# EAGLE design Arduino_Pro_Mini_Mother_Board_1.1 (EAGLE 7.3.0)
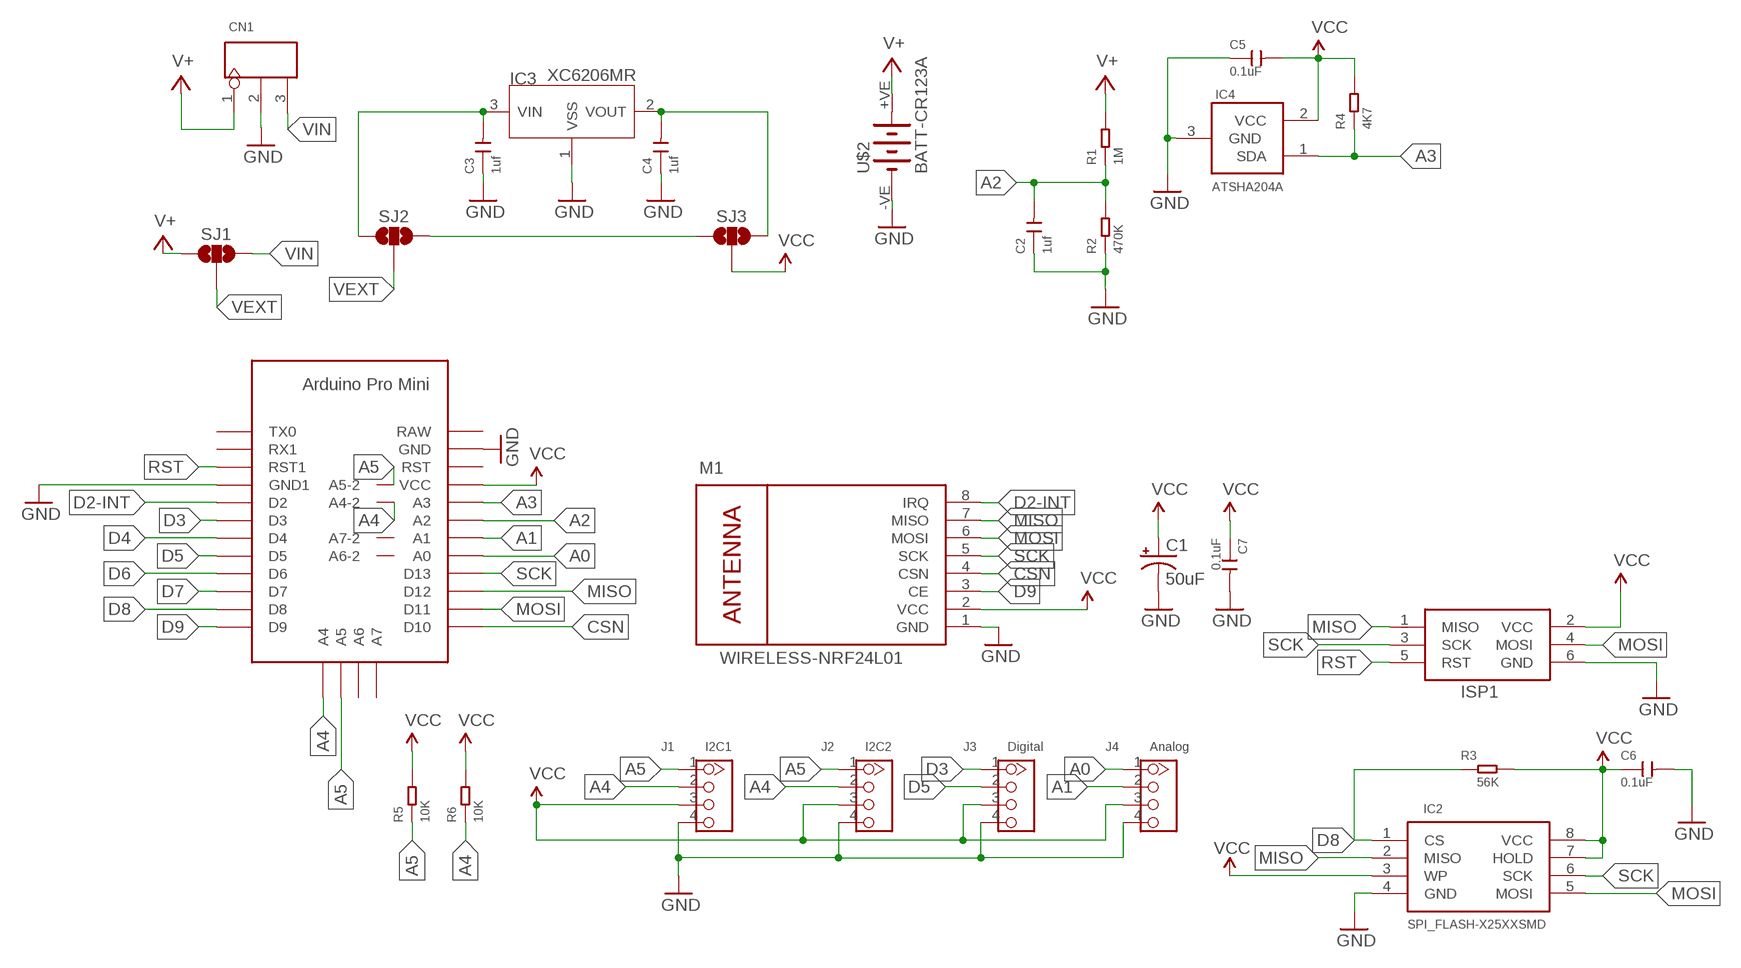
[diagram p0: schematic, sheet 1]

## Parts
ARDUINOPROMINI  PRO-MINI-UNIVERSAL  [PRO-MINI-UINIVERSAL]
C1  50uF  CAP_POL6032  [EIA6032]
C2  1uf  CERAMIC-1UF-25V-10%-X7R(0603)  [C0603]
C3  1uf  CERAMIC-1UF-25V-10%-X7R(0603)  [C0603]
C4  1uf  CERAMIC-1UF-25V-10%-X7R(0603)  [C0603]
C5  0.1uF  CERAMIC-1UF-25V-10%-X7R(0603)  [C0603]
C6  0.1uF  CERAMIC-1UF-25V-10%-X7R(0603)  [C0603]
C7  0.1uF  CERAMIC-1UF-25V-10%-X7R(0603)  [C0603]
CN1  DIP-BLACK-MALE-HEADER-VERT(3P-2.54)  [H3-2.54]
IC2  SPI_FLASH-X25XXSMD  [SO08]
IC3  XC6206MR  [SOT23]
IC4  ATSHA204A  [SOT23]
ISP1  AVRISP-6  [AVRISP]
J1  I2C1  GROVE-CONNECTOR-DIP(4P-2.0)  [HW4-2.0]
J2  I2C2  GROVE-CONNECTOR-DIP(4P-2.0)  [HW4-2.0]
J3  Digital  GROVE-CONNECTOR-DIP(4P-2.0)  [HW4-2.0]
J4  Analog  GROVE-CONNECTOR-DIP(4P-2.0)  [HW4-2.0]
M1  WIRELESS-NRF24L01  [WIRELESS-NRF24L01]
R1  1M  SMD-RES-1M-1%-1/10W(0603)  [R0603]
R2  470K  SMD-RES-470K-1%-1/10W(0603)  [R0603]
R3  56K  SMD-RES-470K-1%-1/10W(0603)  [R0603]
R4  4K7  SMD-RES-470K-1%-1/10W(0603)  [R0603]
R5  10K  SMD-RES-1M-1%-1/10W(0603)  [R0603]
R6  10K  SMD-RES-1M-1%-1/10W(0603)  [R0603]
SJ1  SOLDERJUMPER_2WAYS  [SJ_3]
SJ2  SOLDERJUMPER_2WAYS  [SJ_3]
SJ3  SOLDERJUMPER_2WAYS  [SJ_3]
U$2  BATT-CR123A  [KEYSTONE-2/3A]

## Nets
A0: ARDUINOPROMINI.A0 J4.1
A1: ARDUINOPROMINI.A1 J4.2
A2: ARDUINOPROMINI.A2 C2.2 R1.1 R2.2
A3: ARDUINOPROMINI.A3 IC4.1(SDA) R4.1
A4: ARDUINOPROMINI.A4 ARDUINOPROMINI.A4-2 J1.2 J2.2 R6.1
A5: ARDUINOPROMINI.A5 ARDUINOPROMINI.A5-2 J1.1 J2.1 R5.1
CSN: ARDUINOPROMINI.D10 M1.4(CSN)
D2-INT: ARDUINOPROMINI.D2 M1.8(IRQ)
D3: ARDUINOPROMINI.D3 J3.1
D4: ARDUINOPROMINI.D4
D5: ARDUINOPROMINI.D5 J3.2
D6: ARDUINOPROMINI.D6
D7: ARDUINOPROMINI.D7
D8: ARDUINOPROMINI.D8 IC2.1(CS) R3.1
D9: ARDUINOPROMINI.D9 M1.3(CE)
GND [GND]: ARDUINOPROMINI.GND0(GND) ARDUINOPROMINI.GND1 C1.P$2(-) C2.1 C3.1 C4.1 C5.1 C6.2 C7.2 CN1.2 IC2.4(GND) IC3.1(VSS) IC4.3(GND) ISP1.6(GND) J1.4 J2.4 J3.4 J4.4 M1.1(GND) R2.1 U$2.-VE(-)
MISO: ARDUINOPROMINI.D12 IC2.2(MISO) ISP1.1(MISO) M1.7(MISO)
MOSI: ARDUINOPROMINI.D11 IC2.5(MOSI) ISP1.4(MOSI) M1.6(MOSI)
RST: ARDUINOPROMINI.RST1 ISP1.5(RST)
SCK: ARDUINOPROMINI.D13 IC2.6(SCK) ISP1.3(SCK) M1.5(SCK)
V2 [VCC]: SJ2.3 SJ3.1
V4 [VDD]: C4.2 IC3.2(VOUT) SJ3.3
V+ [VCC]: CN1.1 R1.2 SJ1.1 U$2.+VE(+)
VCC [VCC]: ARDUINOPROMINI.VCC C1.P$1(+) C5.2 C6.1 C7.1 IC2.3(WP) IC2.7(HOLD) IC2.8(VCC) IC4.2(VCC) ISP1.2(VCC) J1.3 J2.3 J3.3 J4.3 M1.2(VCC) R3.2 R4.2 R5.2 R6.2 SJ3.2
VEXT [VCC]: SJ1.2 SJ2.2
VIN [VCC]: C3.2 CN1.3 IC3.3(VIN) SJ1.3 SJ2.1
Unconnected: ARDUINOPROMINI.A6 ARDUINOPROMINI.A6-2 ARDUINOPROMINI.A7 ARDUINOPROMINI.A7-2 ARDUINOPROMINI.RAW ARDUINOPROMINI.RST ARDUINOPROMINI.RX1 ARDUINOPROMINI.TX0

## Library data of the parts
ARDUINOPROMINI = Arduino-clone:PRO-MINI-UNIVERSAL
C1 = SparkFun-Capacitors:CAP_POL: Capacitor Polarized These are standard SMD and PTH capacitors. Normally 10uF, 47uF, and 100uF in electrolytic and tantalum varieties. Always verify the external diameter of the through hole cap, it varies with capacity, voltage, and manufacturer. The EIA devices should be standard.
C2-C4 = Seeed-OPL-Capacitor:CERAMIC-1UF-25V-10%-X7R(0603): 302010139; MPN: CC0603KRX7R8BB105
C5-C7 = Seeed-OPL-Capacitor:CERAMIC-1UF-25V-10%-X7R(0603): 302010139; MPN: CC0603KRX7R8BB105; VALUE: 1uf
CN1 = Seeed-OPL-Connector:DIP-BLACK-MALE-HEADER-VERT(3P-2.54): 320020079
IC2 = SparkFun-DigitalIC:SPI_FLASH-X25XX: 8pin SPI Flash series x25xx. Works with devices like W25X32 and BR25L32
IC3 = IC:XC6206: LOW ESR Cap.Compatible Positive Voltage Regulators
IC4 = Sensor:ATSHA204A
ISP1 = adafruit:AVRISP: AVR ISP HEADER Standard 6 pin header for AVR programming
J1-J4 = Seeed-OPL-Connector:GROVE-CONNECTOR-DIP(4P-2.0): 320110033
M1 = diy-modules:WIRELESS-NRF24L01: 2.4 GHz Wireless Module based on NRF24L01 chip
R1 = Seeed-OPL-Resistor:SMD-RES-1M-1%-1/10W(0603): 301010151; MPN: RC0603FR-071ML
R2 = Seeed-OPL-Resistor:SMD-RES-470K-1%-1/10W(0603): 301010190; MPN: RC0603FR-07470KL
R3 R4 = Seeed-OPL-Resistor:SMD-RES-470K-1%-1/10W(0603): 301010190; MPN: RC0603FR-07470KL; VALUE: 470K
R5 R6 = Seeed-OPL-Resistor:SMD-RES-1M-1%-1/10W(0603): 301010151; MPN: RC0603FR-071ML; VALUE: 1M
SJ1-SJ3 = SparkFun-Retired:SOLDERJUMPER_2WAY: Solder Jumper 2 way solder jumper
U$2 = eagle-library-edeca.net-v5:BATT-CR123A: CR123A (2/3rd AA) battery holder Manufacturer: Keystone Mouser part: 534-1019

## Net classes
0 default: width 0.254 mm, drill 0.254 mm, clearance 0.254 mm
1 VCC: width 0.381 mm, drill 0.381 mm, clearance 0.254 mm
2 3V3: width 0.381 mm, drill 0.381 mm, clearance 0.254 mm
3 GND: width 0.381 mm, drill 0.381 mm, clearance 0.254 mm
4 VDD: width 0.381 mm, drill 0.381 mm, clearance 0.254 mm

## Board
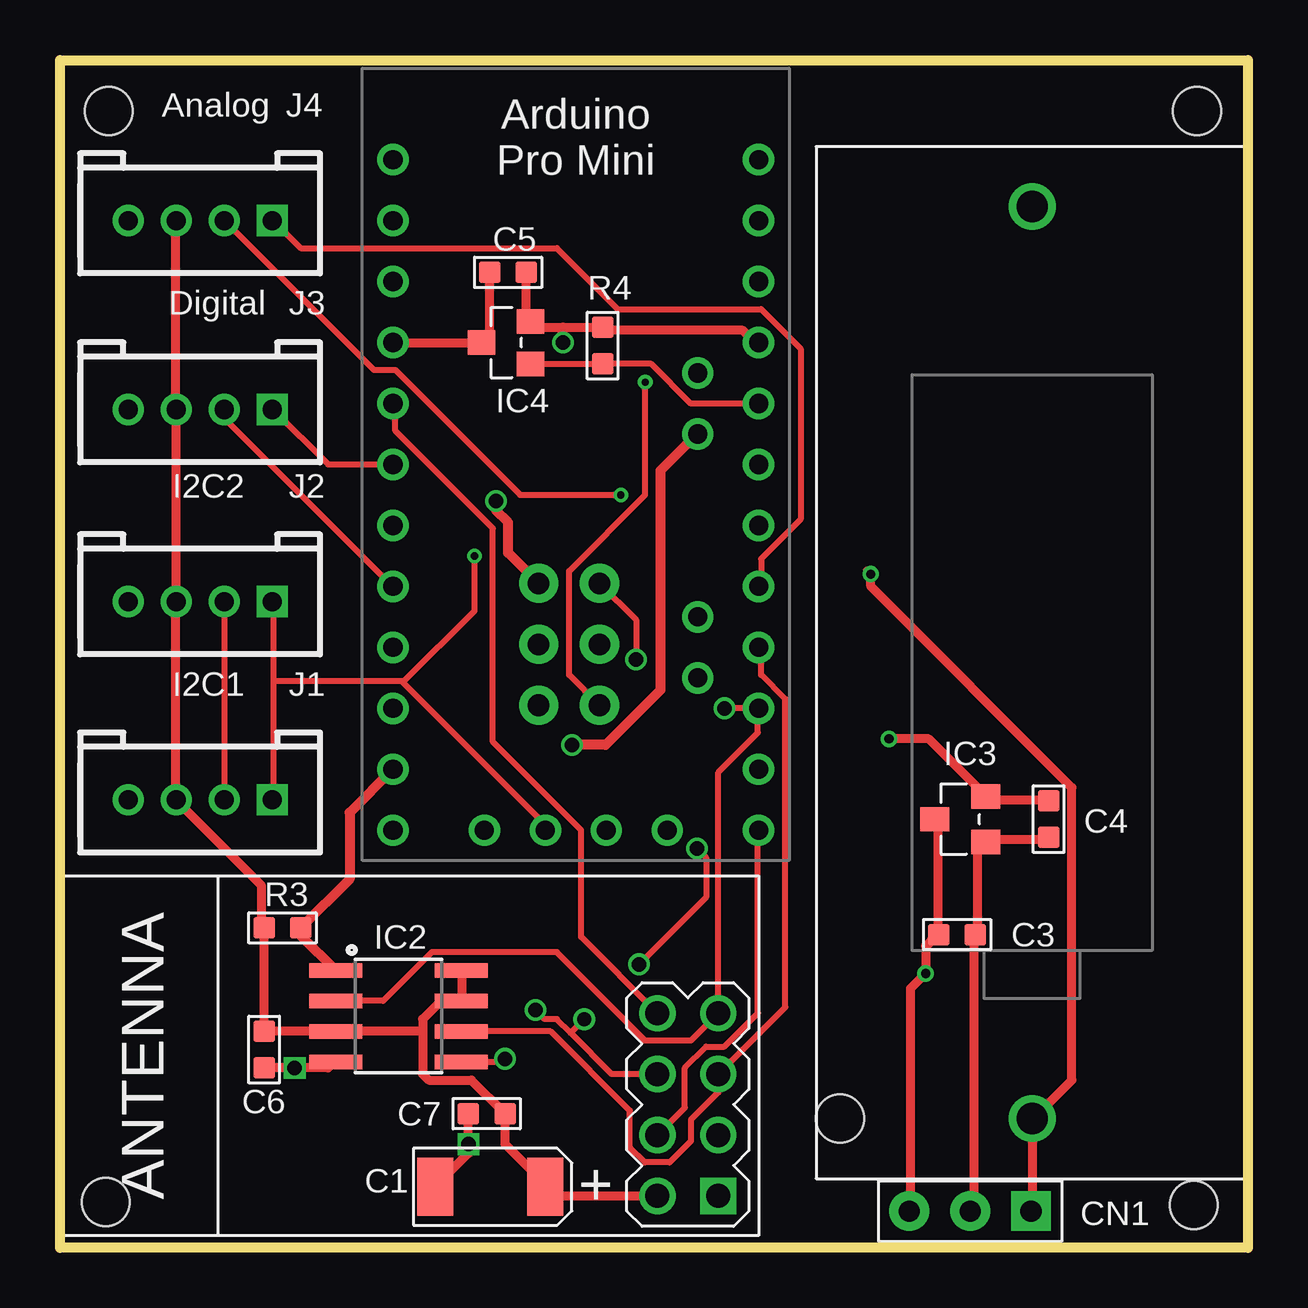
[diagram p1: board, top side]
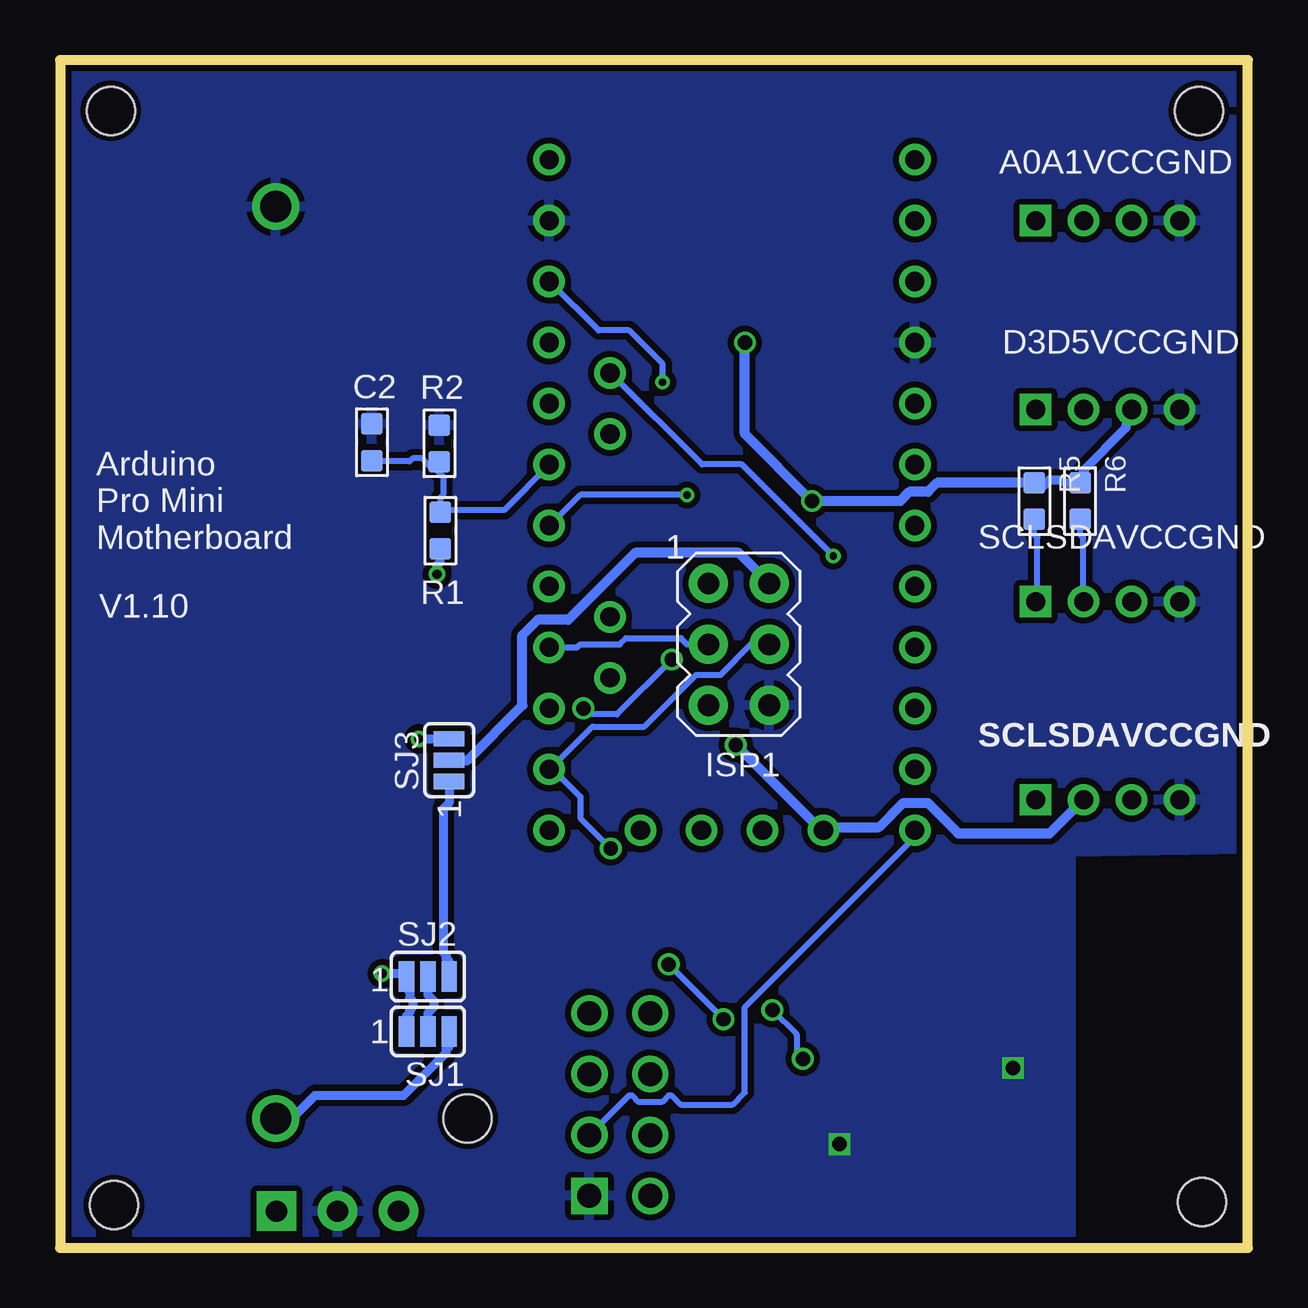
[diagram p2: board, bottom side, seen from below]

Size 49.49 x 49.49 mm. Coordinates in mm from the lower left corner, seen from the top.
Outline: 0,0 0,49.49 49.49,49.49 49.49,0 0,0
Copper layers (1*16): Top 0.035mm / dielectric 1.5mm / Bottom 0.035mm
Design rules "SeeedStudio_2layer_DRU_no_angle_20140221": minimum track width 6mil, minimum drill 12mil, track to track 6mil, track to pad 6mil, pad to pad 6mil, via to via 6mil, smd to smd 0mil, copper to edge 10mil, drill to drill 10mil, minimum pad ring 10mil, minimum via ring 6mil, stop-mask expansion 2mil, vias tented up to drill 100mil, thermal gap 10mil
Holes 2 mm at 2.03,47.37 1.91,1.91 47.24,1.78 47.37,47.37

### Footprints (pad centres in the part's own frame; a part is rotated, then mirrored left to right if it is on the bottom)
PRO-MINI-UINIVERSAL = drill 0.8: A0 7.62,-3.81; A1 7.62,-1.27; A2 7.62,1.27; A3 7.62,3.81; A4 -3.81,-13.97; A4-2 5.08,2.54; A5 -1.27,-13.97; A5-2 5.08,5.08; A6 1.27,-13.97; A6-2 5.08,-7.62; A7 3.81,-13.97; A7-2 5.08,-5.08; D2 -7.62,3.81; D3 -7.62,1.27; D4 -7.62,-1.27; D5 -7.62,-3.81; D6 -7.62,-6.35; D7 -7.62,-8.89; D8 -7.62,-11.43; D9 -7.62,-13.97; D10 7.62,-13.97; D11 7.62,-11.43; D12 7.62,-8.89; D13 7.62,-6.35; GND0 -7.62,6.35; GND1 7.62,11.43; RAW 7.62,13.97; RST -7.62,8.89; RST1 7.62,8.89; RX1 -7.62,11.43; TX0 -7.62,13.97; VCC 7.62,6.35
EIA6032 = smd 1.5 x 2.4: P$1 -2.3,0; P$2 2.3,0
C0603 = smd 0.889 x 0.889: 1 0,0.762; 2 0,-0.762
H3-2.54 = drill 0.889 pad 1.651 square: 1 0,2.54 | drill 0.889 pad 1.651: 2 0,0; 3 0,-2.54
SO08 = smd 0.61 x 2.21: 1 -1.905,-2.616; 2 -0.635,-2.616; 3 0.635,-2.616; 4 1.905,-2.616; 5 1.905,2.616; 6 0.635,2.616; 7 -0.635,2.616; 8 -1.905,2.616
SOT23 = smd 1.016 x 1.2: 1 -0.95,-1.06; 2 0.95,-1.06; 3 0,1.06
SOT23' = smd 1.016 x 1.143: 1 -0.889,-1.016; 2 0.889,-1.016; 3 0,1.016
AVRISP = drill 0.9 pad 1.626: 1 -1.27,2.54; 2 1.27,2.54; 3 -1.27,0; 4 1.27,0; 5 -1.27,-2.54; 6 1.27,-2.54
HW4-2.0 = drill 0.8 pad 1.27 square: 1 -3,0 | drill 0.8 pad 1.27: 2 -1,0; 3 1,0; 4 3,0
WIRELESS-NRF24L01 = drill 1 square: 1 -12.7,6.35 | drill 1: 2 -10.16,6.35; 3 -12.7,3.81; 4 -10.16,3.81; 5 -12.7,1.27; 6 -10.16,1.27; 7 -12.7,-1.27; 8 -10.16,-1.27
R0603 = smd 0.889 x 0.889: 1 0,0.762; 2 0,-0.762
SJ_3 = smd 0.635 x 1.27: 1 -0.889,0; 2 0,0; 3 0.889,0
KEYSTONE-2/3A = drill 1.3: +VE 0,19; -VE 0,-19 | hole 2: 8,19

### Placement (x,y rotation side)
ARDUINOPROMINI  21.49,31.37 0 top
C1  17.93,2.54 180 top
C2  36.5,33.56 0 bottom
C3  37.38,13.05 270 top
C4  41.2,17.86 180 top
C5  18.67,40.64 90 top
C6  8.51,8.26 0 top
C7  17.78,5.59 270 top
CN1  37.92,1.53 270 top
IC2  14.1,9.65 270 top
IC3  37.51,17.86 90 top
IC4  ATSHA204A  [SOT23']  18.58,37.72 90 top
ISP1  21.21,25.15 0 bottom
J1  5.84,18.67 180 top
J2  5.84,26.92 180 top
J3  5.84,34.93 180 top
J4  5.84,42.8 180 top
M1  14.73,8.51 180 top
R1  33.64,29.88 0 bottom
R2  33.68,33.51 0 bottom
R3  9.27,13.34 270 top
R4  22.61,37.59 180 top
R5  8.89,31.11 180 bottom
R6  6.99,31.11 180 bottom
SJ1  34.16,9.02 180 bottom
SJ2  34.16,11.3 0 bottom
SJ3  33.27,20.32 90 bottom
U$2  40.51,24.38 180 top

### Tracks (layer width: path | path; a pad name or v marks a point on that pad's centre or on a via)
A0
  Top 0.254: ARDUINOPROMINI.A0 29.21,27.56 29.21,28.7 30.86,30.35 30.86,37.47 29.21,39.12 23.24,39.12 20.7,41.66 10.03,41.66 8.89,42.8 J4.1
A1  (via drill 0.3)
  Top 0.254: v23.37,31.37 19.18,31.37 13.97,36.58 13.08,36.58 6.86,42.8 J4.2
  Bottom 0.254: v23.37,31.37 27.81,31.37 29.08,30.1 ARDUINOPROMINI.A1
A2
  Bottom 0.254: 33.78,32.51 33.78,32.64 R2.2 33.78,32.51 | 33.78,32.51 33.78,32.38 33.53,32.13 33.53,31.37 33.66,31.24 33.66,30.73 R1.1 33.53,30.73 30.99,30.73 29.08,32.64 ARDUINOPROMINI.A2 | 33.78,32.51 34.04,32.51 34.42,32.89 34.8,32.89 34.92,32.77 36.45,32.77 C2.2
A3
  Top 0.254: IC4.1 19.68,36.83 R4.1 24.64,36.83 26.29,35.18 ARDUINOPROMINI.A3
A4  (via drill 0.6)
  Top 0.254: J2.2 6.86,26.92 6.86,18.8 J1.2
  Top 0.406: v21.34,20.95 22.73,20.95 25.02,23.24 25.02,32.38 26.54,33.91 ARDUINOPROMINI.A4-2
  Bottom 0.254: R6.1 6.99,29.72 6.86,29.59 6.86,26.92 J2.2
  Bottom 0.406: v21.34,20.95 17.78,17.4 ARDUINOPROMINI.A4 17.53,17.53 15.37,17.53 14.35,18.54 13.34,18.54 12.06,17.27 8.26,17.27 6.86,18.67 J1.2
A5  (via drill 0.3)
  Top 0.254: 8.89,23.62 8.89,26.92 J2.1 | 8.89,23.62 8.89,18.67 J1.1 | 14.29,23.56 14.22,23.62 8.89,23.62 | 14.29,23.56 20.19,17.65 20.19,17.4 ARDUINOPROMINI.A5 | v17.27,28.83 17.27,26.54 14.29,23.56
  Bottom 0.254: v17.27,28.83 21.08,32.64 22.73,32.64 26.54,36.45 ARDUINOPROMINI.A5-2 | R5.1 8.89,29.72 8.76,29.59 8.76,26.92 J2.1
CSN
  Top 0.254: M1.4 26.04,5.84 26.04,7.49 26.92,8.38 27.69,8.38 29.08,9.78 29.08,17.4 ARDUINOPROMINI.D10
D2-INT
  Top 0.254: M1.8 21.72,12.95 21.72,17.4 18.03,21.08 18.03,29.97 13.97,34.04 13.97,35.18 ARDUINOPROMINI.D2
D3
  Top 0.254: ARDUINOPROMINI.D3 11.18,32.64 8.89,34.92 J3.1
D5
  Top 0.254: J3.2 6.86,34.92 6.86,34.54 13.84,27.56 ARDUINOPROMINI.D5
D8
  Top 0.406: ARDUINOPROMINI.D8 12.06,18.13 12.06,15.37 R3.1 10.03,13.01 IC2.1
D9
  Bottom 0.254: M1.3 25.78,6.35 25.65,6.35 25.4,6.1 24.38,6.1 24.13,6.35 24,6.35 23.62,5.97 21.46,5.97 20.95,6.48 20.95,10.03 13.97,17.02 13.97,17.4 ARDUINOPROMINI.D9
GND  (via drill 0.6)
  Top 0.381: C5.1 17.91,37.97 17.65,37.72 IC4.3 17.4,37.72 ARDUINOPROMINI.GND0 | C4.1 41.15,17.02 38.73,17.02 IC3.1 38.48,16.89 38.23,16.64 38.23,13.08 C3.1 38.1,12.95 38.1,1.78 37.97,1.65 CN1.2 | C6.2 v9.78,7.49 11.18,7.49 11.43,7.75 IC2.4 | C7.2 v17.02,4.32 17.02,3.94 15.75,2.67 C1.P$2 | 2.92,18.67 J1.4
  pour Bottom: 0,16.63 0,49.62 49.49,49.49 49.49,0 7.37,0 7.37,16.5
MISO  (via drill 0.6)
  Top 0.254: IC2.2 13.46,10.29 15.49,12.32 20.7,12.32 24.38,8.64 26.29,8.64 M1.7 27.43,19.81 29.08,21.46 29.08,22.48 | 29.08,22.48 v27.69,22.48 | 29.08,22.48 ARDUINOPROMINI.D12 | v24,24.51 24,26.16 ISP1.1
  Bottom 0.254: v27.69,22.48 27.43,22.23 26.29,22.23 v24,24.51
MOSI  (via drill 0.6)
  Top 0.254: v19.81,9.91 20.19,9.53 20.7,9.53 21.27,8.95 | 21.27,8.95 22.99,7.24 M1.6 | v18.54,7.87 18.41,7.87 18.29,7.75 IC2.5 | 21.27,8.95 v21.84,9.53 | v24.13,11.81 26.92,14.61 26.92,16.26 v26.54,16.64
  Bottom 0.254: ISP1.4 20.7,25.15 21.97,23.88 22.99,23.88 25.15,21.72 27.3,21.72 29.08,19.94 ARDUINOPROMINI.D11 28.96,19.94 27.81,18.8 27.81,17.91 v26.54,16.64 | v19.81,9.91 18.8,8.89 18.8,7.87 v18.54,7.87 | v21.84,9.53 v24.13,11.81
RST  (via drill 0.3)
  Top 0.254: v24.38,36.07 24.38,31.37 21.21,28.19 21.21,23.88 ISP1.5
  Bottom 0.254: v24.38,36.07 24.38,36.83 25.78,38.23 27.05,38.23 29.08,40.26 ARDUINOPROMINI.RST1
SCK
  Top 0.254: ARDUINOPROMINI.D13 29.21,25.02 29.21,23.88 30.23,22.86 30.23,10.03 M1.5 27.43,6.48 26.29,5.33 26.29,4.45 25.4,3.56 24.38,3.56 23.75,4.19 23.75,5.71 20.45,9.02 IC2.6
  Bottom 0.254: ISP1.3 23.37,25.15 23.62,25.4 25.91,25.4 26.16,25.15 27.81,25.15 27.94,25.02 ARDUINOPROMINI.D13
V2
  Bottom 0.381: SJ2.3 33.27,11.94 33.4,12.06 33.4,12.19 33.53,12.32 33.53,18.29 33.27,18.54 SJ3.1
V4  (via drill 0.38)
  Top 0.381: C4.2 41.15,18.67 38.73,18.67 38.61,18.8 IC3.2 38.48,18.92 36.2,21.21 v34.54,21.21
  Bottom 0.381: v34.54,21.21 SJ3.3
V+  (via drill 0.38)
  Top 0.381: CN1.1 40.51,1.65 40.51,5.33 U$2.+VE 40.64,5.46 42.16,6.99 42.16,19.18 33.78,27.56 v33.78,28.07 33.66,28.19
  Bottom 0.381: v33.78,28.07 33.78,28.45 33.66,28.57 33.66,29.08 R1.2 | SJ1.1 33.27,8.38 33.4,8.26 33.4,8.13 35.18,6.35 38.86,6.35 39.75,5.46 40.39,5.46 U$2.+VE
VCC  (via drill 0.6)
  Top 0.381: C5.2 19.43,38.61 IC4.2 19.68,38.48 19.81,38.35 20.95,38.35 R4.2 22.73,38.23 28.45,38.23 28.96,37.72 ARDUINOPROMINI.VCC | IC2.8 16.76,11.56 16.76,10.41 IC2.7 15.88,10.29 15.11,9.53 15.11,9.02 | M1.2 20.57,2.16 20.32,2.41 C1.P$1 20.19,2.67 18.54,4.32 C7.1 17.14,6.99 15.37,6.99 15.11,7.24 15.11,9.02 | J4.3 4.83,42.8 4.83,35.05 J3.3 4.83,34.92 4.83,26.92 J2.3 4.83,26.8 4.83,18.8 J1.3 | 15.11,9.02 IC2.3 C6.1 R3.2 8.38,13.46 8.38,15.11 5.08,18.41 J1.3 | 4.95,18.54 J1.3
  Top 0.406: v20.95,37.72 20.95,38.35 | v18.16,31.11 18.16,30.73 18.67,30.23 18.67,28.96 ISP1.2
  Bottom 0.381: R5.2 8.76,31.75 8.51,31.75 8.26,32 7.75,32 7.62,31.88 R6.2 6.86,32 6.86,32.38 5.08,34.16 5.08,34.29 4.95,34.42 4.95,34.92 J3.3
  Bottom 0.406: v20.95,37.72 20.95,33.91 v18.16,31.11 14.48,31.11 14.1,31.5 13.34,31.5 12.95,31.88 R5.2 | SJ3.2 32.51,20.32 30.23,22.61 30.23,25.53 29.59,26.16 28.32,26.16 25.53,28.96 21.21,28.96 ISP1.2
VEXT
  Bottom 0.381: SJ1.2 34.16,9.78 33.91,10.03 33.91,10.29 34.16,10.54 SJ2.2
VIN  (via drill 0.38)
  Top 0.381: IC3.3 36.45,17.78 36.58,17.65 36.58,13.08 C3.2 36.45,12.95 36.07,12.57 v36.07,11.43 35.43,10.79 35.43,1.65 CN1.3
  Bottom 0.381: SJ1.3 35.05,9.65 34.92,9.78 34.92,9.91 34.8,10.03 34.8,10.29 34.92,10.41 34.92,10.67 35.05,10.79 SJ2.1 35.18,11.43 v36.07,11.43

### Text on the board
tNames: C1 | +
bNames: A0A1VCCGND | D3D5VCCGND | SCLSDAVCCGND | Arduino / Pro Mini / Motherboard | V1.10 | SCLSDAVCCGND | 1 | 1 | 1